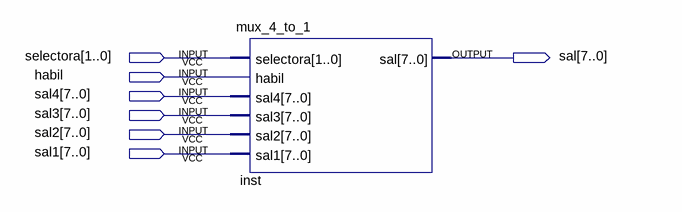
[diagram p0: schematic sheet]
// Quartus schematic block2.bdf as structural Verilog: 1 symbols, 7 pins
module block2 (
  input  [1:0] selectora,
  input  habil,
  input  [7:0] sal4,
  input  [7:0] sal3,
  input  [7:0] sal2,
  input  [7:0] sal1,
  output [7:0] sal
);

  mux_4_to_1 inst (.selectora(selectora), .habil(habil), .sal4(sal4), .sal3(sal3), .sal2(sal2), .sal1(sal1), .sal(sal));
endmodule
